# EAGLE schematic LightingControl (EAGLE 9.2.0)
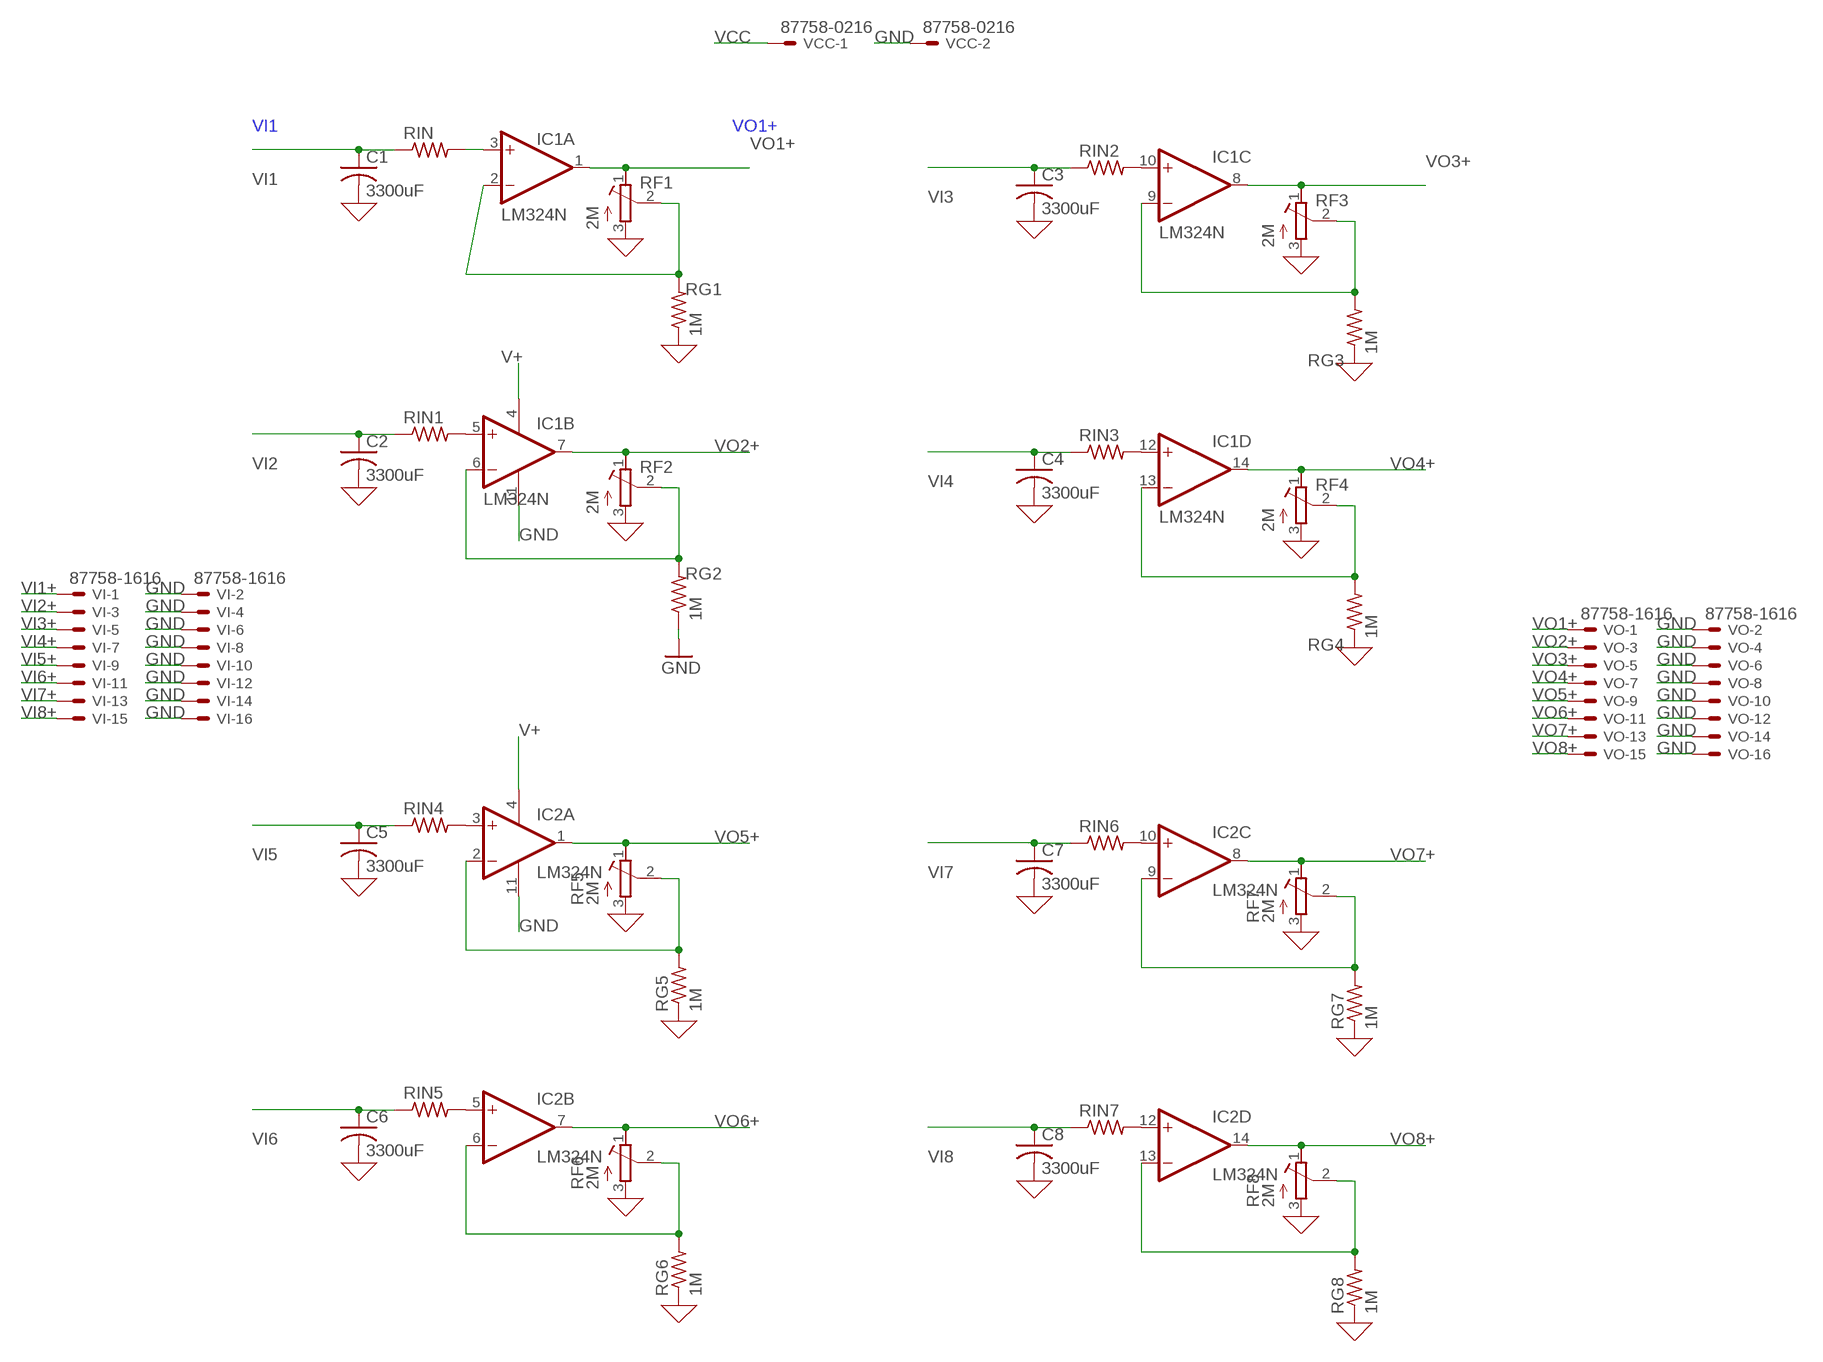
[diagram p0: schematic, sheet 1]

## Parts
C1  3300uF  C-US025-024X044  [C025-024X044]
C2  3300uF  C-US025-024X044  [C025-024X044]
C3  3300uF  C-US025-024X044  [C025-024X044]
C4  3300uF  C-US025-024X044  [C025-024X044]
C5  3300uF  C-US025-024X044  [C025-024X044]
C6  3300uF  C-US025-024X044  [C025-024X044]
C7  3300uF  C-US025-024X044  [C025-024X044]
C8  3300uF  C-US025-024X044  [C025-024X044]
IC1  LM324N  [DIL14]
IC2  LM324N  [DIL14]
RF1  2M  R-TRIMM3314G  [RTRIM3314G]
RF2  2M  R-TRIMM3314G  [RTRIM3314G]
RF3  2M  R-TRIMM3314G  [RTRIM3314G]
RF4  2M  R-TRIMM3314G  [RTRIM3314G]
RF5  2M  R-TRIMM3314G  [RTRIM3314G]
RF6  2M  R-TRIMM3314G  [RTRIM3314G]
RF7  2M  R-TRIMM3314G  [RTRIM3314G]
RF8  2M  R-TRIMM3314G  [RTRIM3314G]
RG1  1M  R-US_0207/10  [0207/10]
RG2  1M  R-US_0207/10  [0207/10]
RG3  1M  R-US_0207/10  [0207/10]
RG4  1M  R-US_0207/10  [0207/10]
RG5  1M  R-US_0207/10  [0207/10]
RG6  1M  R-US_0207/10  [0207/10]
RG7  1M  R-US_0207/10  [0207/10]
RG8  1M  R-US_0207/10  [0207/10]
RIN  R-US_0207/10  [0207/10]
RIN1  R-US_0207/10  [0207/10]
RIN2  R-US_0207/10  [0207/10]
RIN3  R-US_0207/10  [0207/10]
RIN4  R-US_0207/10  [0207/10]
RIN5  R-US_0207/10  [0207/10]
RIN6  R-US_0207/10  [0207/10]
RIN7  R-US_0207/10  [0207/10]
VCC  87758-0216  [87758-0216]
VI  87758-1616  [87758-1616]
VO  87758-1616  [87758-1616]

## Nets
0: C1.2 C2.2 C3.2 C4.2 C5.2 C6.2 C7.2 C8.2 RF1.3(A) RF2.3(A) RF3.3(A) RF4.3(A) RF5.3(A) RF6.3(A) RF7.3(A) RF8.3(A) RG1.1 RG3.1 RG4.1 RG5.1 RG6.1 RG7.1 RG8.1 ; supply symbol labelled GND
GND: IC1.11(P:V-) IC2.11(P:V-) RG2.1 VCC.2 VI.2 VI.4 VI.6 VI.8 VI.10 VI.12 VI.14 VI.16 VO.2 VO.4 VO.6 VO.8 VO.10 VO.12 VO.14 VO.16
N$1: IC1.3(A:+IN) RIN.2
N$2: IC1.2(A:-IN) RF1.2(S) RG1.2
N$3: IC1.6(B:-IN) RF2.2(S) RG2.2
N$4: IC1.5(B:+IN) RIN1.2
N$5: IC1.9(C:-IN) RF3.2(S) RG3.2
N$6: IC1.10(C:+IN) RIN2.2
N$7: IC1.13(D:-IN) RF4.2(S) RG4.2
N$8: IC1.12(D:+IN) RIN3.2
N$9: IC2.2(A:-IN) RF5.2(S) RG5.2
N$10: IC2.3(A:+IN) RIN4.2
N$11: IC2.6(B:-IN) RF6.2(S) RG6.2
N$12: IC2.5(B:+IN) RIN5.2
N$13: IC2.9(C:-IN) RF7.2(S) RG7.2
N$14: IC2.13(D:-IN) RF8.2(S) RG8.2
N$15: IC2.10(C:+IN) RIN6.2
N$16: IC2.12(D:+IN) RIN7.2
V+: IC1.4(P:V+) IC2.4(P:V+)
VCC: VCC.1
VI1: C1.1 RIN.1
VI1+: VI.1
VI2: C2.1 RIN1.1
VI2+: VI.3
VI3: C3.1 RIN2.1
VI3+: VI.5
VI4: C4.1 RIN3.1
VI4+: VI.7
VI5: C5.1 RIN4.1
VI5+: VI.9
VI6: C6.1 RIN5.1
VI6+: VI.11
VI7: C7.1 RIN6.1
VI7+: VI.13
VI8: C8.1 RIN7.1
VI8+: VI.15
VO1+: IC1.1(A:OUT) RF1.1(E) VO.1
VO2+: IC1.7(B:OUT) RF2.1(E) VO.3
VO3+: IC1.8(C:OUT) RF3.1(E) VO.5
VO4+: IC1.14(D:OUT) RF4.1(E) VO.7
VO5+: IC2.1(A:OUT) RF5.1(E) VO.9
VO6+: IC2.7(B:OUT) RF6.1(E) VO.11
VO7+: IC2.8(C:OUT) RF7.1(E) VO.13
VO8+: IC2.14(D:OUT) RF8.1(E) VO.15

## Library data of the parts
C1-C8 = rcl:C-US: CAPACITOR, American symbol; SPICEPREFIX: C
IC1 IC2 = linear:LM324: OP AMP; SPICEPREFIX: X
RF1-RF8 = rcl:R-TRIMM: Trimm resistor; SPICEMODEL: X; SPICEPREFIXL: POT
RG1-RG8 RIN RIN1-RIN7 = rcl:R-US_: RESISTOR, American symbol; SPICEPREFIX: R
VCC = con-molex:87758-0216: 2 Pin - 2mm Dual Row Single Wafer, Vertical T/H HDR Source: http://www.molex.com/pdm_docs/sd/877580616_sd.pdf; MF: MOLEX; MPN: 87758-0216; OC_FARNELL: unknown; OC_NEWARK: 94M1513
VI VO = con-molex:87758-1616: 16 Pin - 2mm Dual Row Single Wafer, Vertical T/H HDR Source: http://www.molex.com/pdm_docs/sd/877580616_sd.pdf; MF: MOLEX; MPN: 87758-1616; OC_FARNELL: 7472366; OC_NEWARK: 59J1563